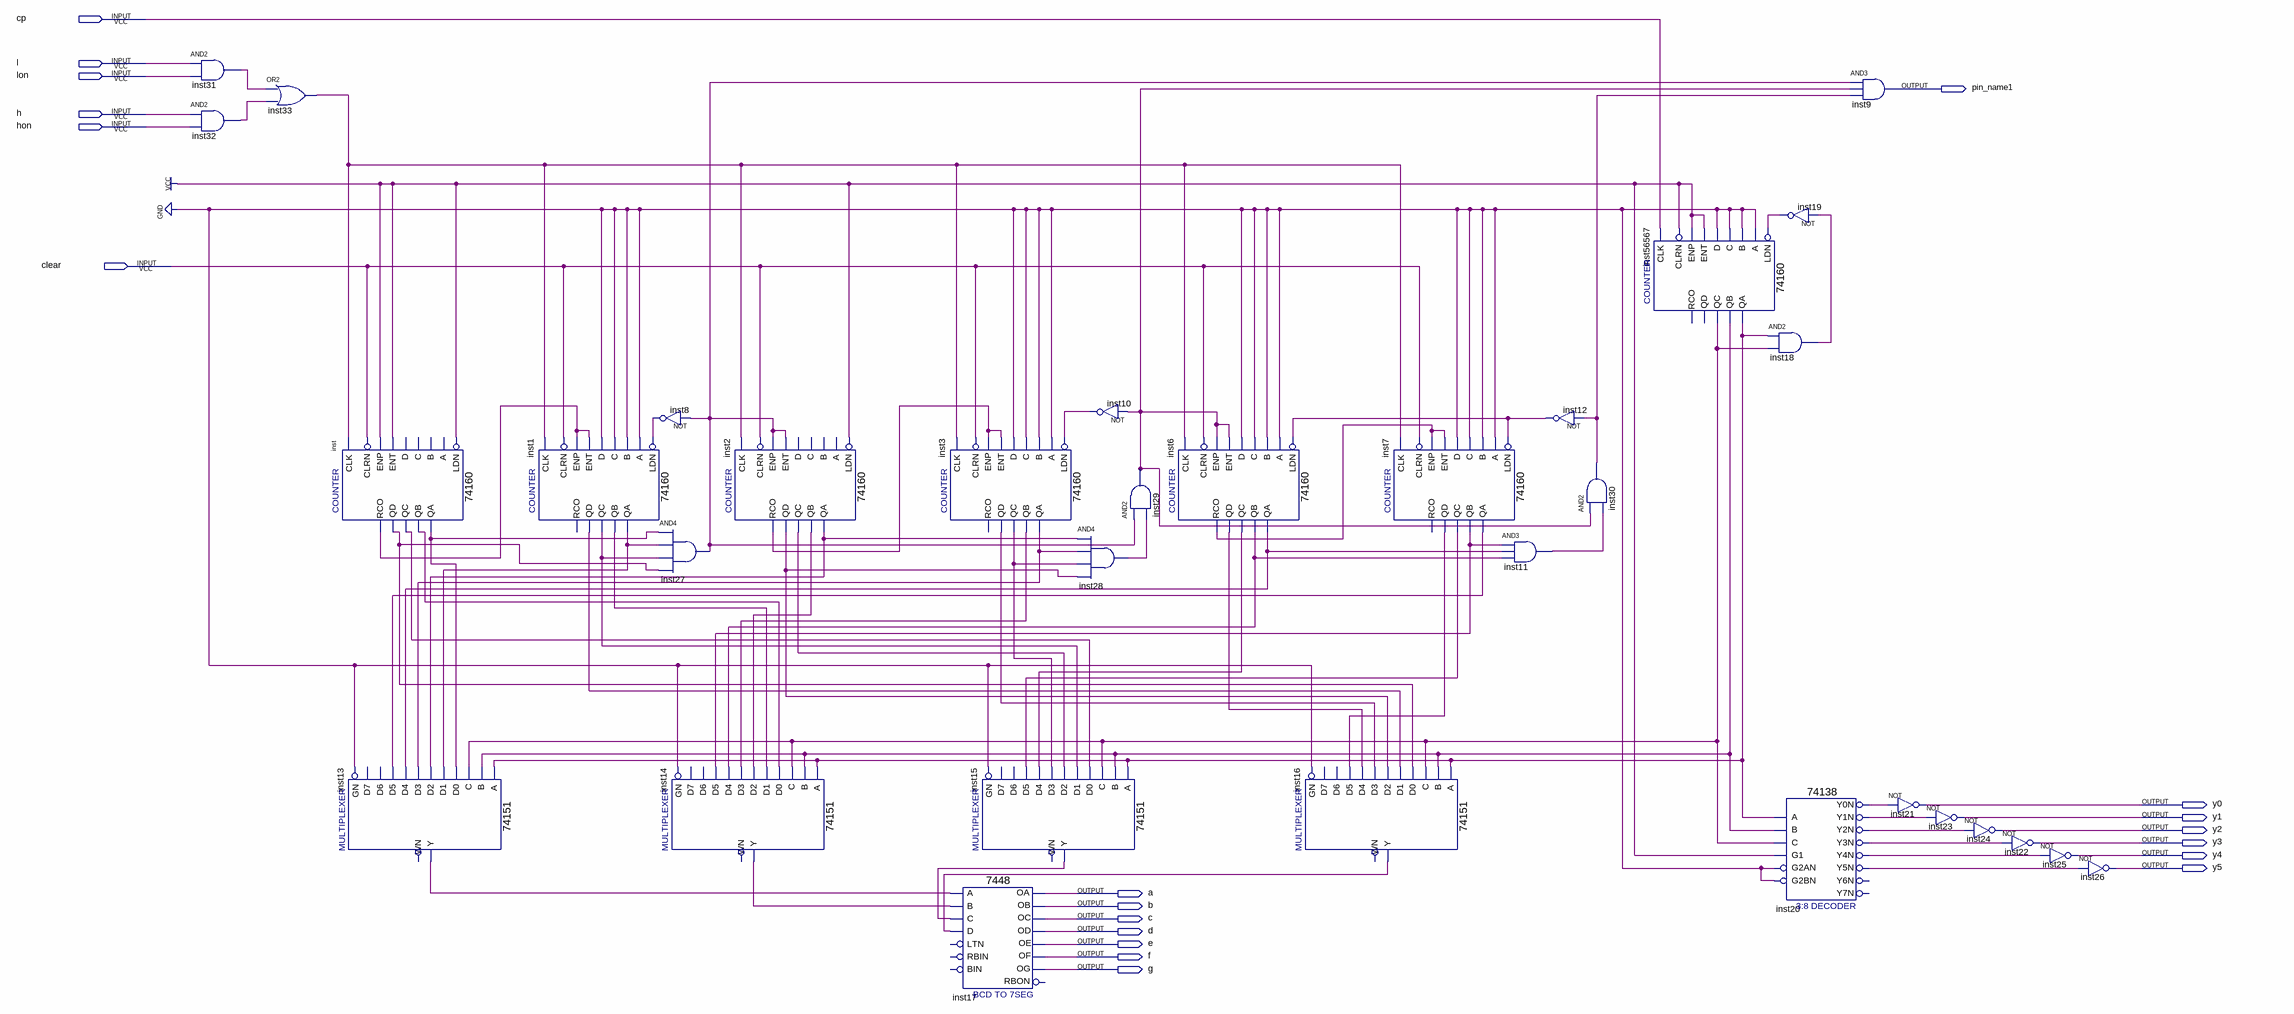
[diagram p0: schematic sheet]
// Quartus schematic t.bdf as structural Verilog: 33 symbols, 20 pins
module t (
  input  cp,
  input  l,
  input  lon,
  input  h,
  input  hon,
  input  clear,
  output pin_name1,
  output y0,
  output y1,
  output y2,
  output y3,
  output y4,
  output y5,
  output a,
  output b,
  output c,
  output d,
  output e,
  output f,
  output g
);

  wire inst1_qa, inst1_qb, inst1_qc, inst1_qd, inst2_qa, inst2_qb, inst2_qc, inst2_qd, inst2_rco, inst3_qa,
       inst3_qb, inst3_qc, inst3_qd, inst6_qa, inst6_qb, inst6_qc, inst6_qd, inst6_rco, inst7_qa, inst7_qb,
       inst7_qc, inst7_qd, inst8_out, inst10_out, inst11_out, inst12_out, inst13_y, inst14_y, inst15_y,
       inst16_y, inst18_out, inst19_out, inst20_y0n, inst20_y1n, inst20_y2n, inst20_y3n, inst20_y4n,
       inst20_y5n, inst27_out, inst28_out, inst29_out, inst30_out, inst31_out, inst32_out, inst33_out,
       inst56567_qa, inst56567_qb, inst56567_qc, inst_qa, inst_qb, inst_qc, inst_qd, inst_rco;

  and inst31 (inst31_out, l, lon);
  and inst32 (inst32_out, h, hon);
  or inst33 (inst33_out, inst31_out, inst32_out);
  \74160  inst (
    .CLK(inst33_out), .ENT(1'b1), .LDN(1'b1), .ENP(1'b1), .CLRN(clear), .QD(inst_qd), .QA(inst_qa),
    .QB(inst_qb), .QC(inst_qc), .RCO(inst_rco));  // open: A, B, C, D
  \74151  inst13 (
    .GN(1'b0), .C(inst56567_qc), .B(inst56567_qb), .A(inst56567_qa), .D5(inst7_qa), .D0(inst_qa),
    .D1(inst1_qa), .D4(inst6_qa), .D3(inst3_qa), .D2(inst2_qa), .Y(inst13_y));  // open: D6, D7, WN
  \74160  inst1 (
    .CLK(inst33_out), .ENT(inst_rco), .A(1'b0), .B(1'b0), .C(1'b0), .D(1'b0), .LDN(inst8_out),
    .ENP(inst_rco), .CLRN(clear), .QD(inst1_qd), .QA(inst1_qa), .QB(inst1_qb), .QC(inst1_qc));  // open: RCO
  not inst8 (inst8_out, inst27_out);
  and inst27 (inst27_out, inst_qa, inst1_qa, inst1_qc, inst_qd);
  \74151  inst14 (
    .GN(1'b0), .C(inst56567_qc), .B(inst56567_qb), .A(inst56567_qa), .D5(inst7_qb), .D0(inst_qb),
    .D1(inst1_qb), .D4(inst6_qb), .D3(inst3_qb), .D2(inst2_qb), .Y(inst14_y));  // open: D6, D7, WN
  \74160  inst2 (
    .CLK(inst33_out), .ENT(inst27_out), .LDN(1'b1), .ENP(inst27_out), .CLRN(clear), .QD(inst2_qd),
    .QA(inst2_qa), .QB(inst2_qb), .QC(inst2_qc), .RCO(inst2_rco));  // open: A, B, C, D
  \74160  inst3 (
    .CLK(inst33_out), .ENT(inst2_rco), .A(1'b0), .B(1'b0), .C(1'b0), .D(1'b0), .LDN(inst10_out),
    .ENP(inst2_rco), .CLRN(clear), .QD(inst3_qd), .QA(inst3_qa), .QB(inst3_qb), .QC(inst3_qc));  // open: RCO
  \7448  inst17 (
    .A(inst13_y), .C(inst15_y), .D(inst16_y), .B(inst14_y), .OC(c), .OE(e), .OD(d), .OF(f), .OG(g), .OB(b),
    .OA(a));  // open: RBIN, BIN, LTN, RBON
  \74151  inst15 (
    .GN(1'b0), .C(inst56567_qc), .B(inst56567_qb), .A(inst56567_qa), .D5(inst7_qc), .D0(inst_qc),
    .D1(inst1_qc), .D4(inst6_qc), .D3(inst3_qc), .D2(inst2_qc), .Y(inst15_y));  // open: D6, D7, WN
  not inst10 (inst10_out, inst29_out);
  and inst28 (inst28_out, inst2_qa, inst3_qa, inst3_qc, inst2_qd);
  \74160  inst6 (
    .CLK(inst33_out), .ENT(inst29_out), .A(1'b0), .B(1'b0), .C(1'b0), .D(1'b0), .LDN(inst12_out),
    .ENP(inst29_out), .CLRN(clear), .QD(inst6_qd), .QA(inst6_qa), .QB(inst6_qb), .QC(inst6_qc),
    .RCO(inst6_rco));
  and inst29 (inst29_out, inst27_out, inst28_out);
  \74151  inst16 (
    .GN(1'b0), .C(inst56567_qc), .B(inst56567_qb), .A(inst56567_qa), .D5(inst7_qd), .D0(inst_qd),
    .D1(inst1_qd), .D4(inst6_qd), .D3(inst3_qd), .D2(inst2_qd), .Y(inst16_y));  // open: D6, D7, WN
  \74160  inst7 (
    .CLK(inst33_out), .ENT(inst6_rco), .A(1'b0), .B(1'b0), .C(1'b0), .D(1'b0), .LDN(inst12_out),
    .ENP(inst6_rco), .CLRN(clear), .QD(inst7_qd), .QA(inst7_qa), .QB(inst7_qb), .QC(inst7_qc));  // open: RCO
  and inst11 (inst11_out, inst7_qb, inst6_qa, inst6_qb);
  not inst12 (inst12_out, inst30_out);
  and inst30 (inst30_out, inst29_out, inst11_out);
  \74160  inst56567 (
    .CLK(cp), .ENT(1'b1), .A(1'b0), .B(1'b0), .C(1'b0), .D(1'b0), .LDN(inst19_out), .ENP(1'b1), .CLRN(1'b1),
    .QA(inst56567_qa), .QB(inst56567_qb), .QC(inst56567_qc));  // open: QD, RCO
  and inst18 (inst18_out, inst56567_qa, inst56567_qc);
  \74138  inst20 (
    .A(inst56567_qa), .B(inst56567_qb), .G1(1'b1), .C(inst56567_qc), .G2AN(1'b0), .G2BN(1'b0),
    .Y0N(inst20_y0n), .Y1N(inst20_y1n), .Y2N(inst20_y2n), .Y3N(inst20_y3n), .Y4N(inst20_y4n), .Y5N(inst20_y5n));  // open: Y6N, Y7N
  not inst19 (inst19_out, inst18_out);
  and inst9 (pin_name1, inst27_out, inst29_out, inst30_out);
  not inst21 (y0, inst20_y0n);
  not inst23 (y1, inst20_y1n);
  not inst24 (y2, inst20_y2n);
  not inst22 (y3, inst20_y3n);
  not inst25 (y4, inst20_y4n);
  not inst26 (y5, inst20_y5n);
endmodule
